# Altium schematic sheet [02] - CPU - IO.SchDoc: Project
size A4; Organization: Tor Brodtkorb; Address1: Frode Rinnans veg 193; Address2: 7050 Trondheim; DocumentNumber: 6598; Revision: 1.0; SheetNumber: 1; SheetTotal: 1
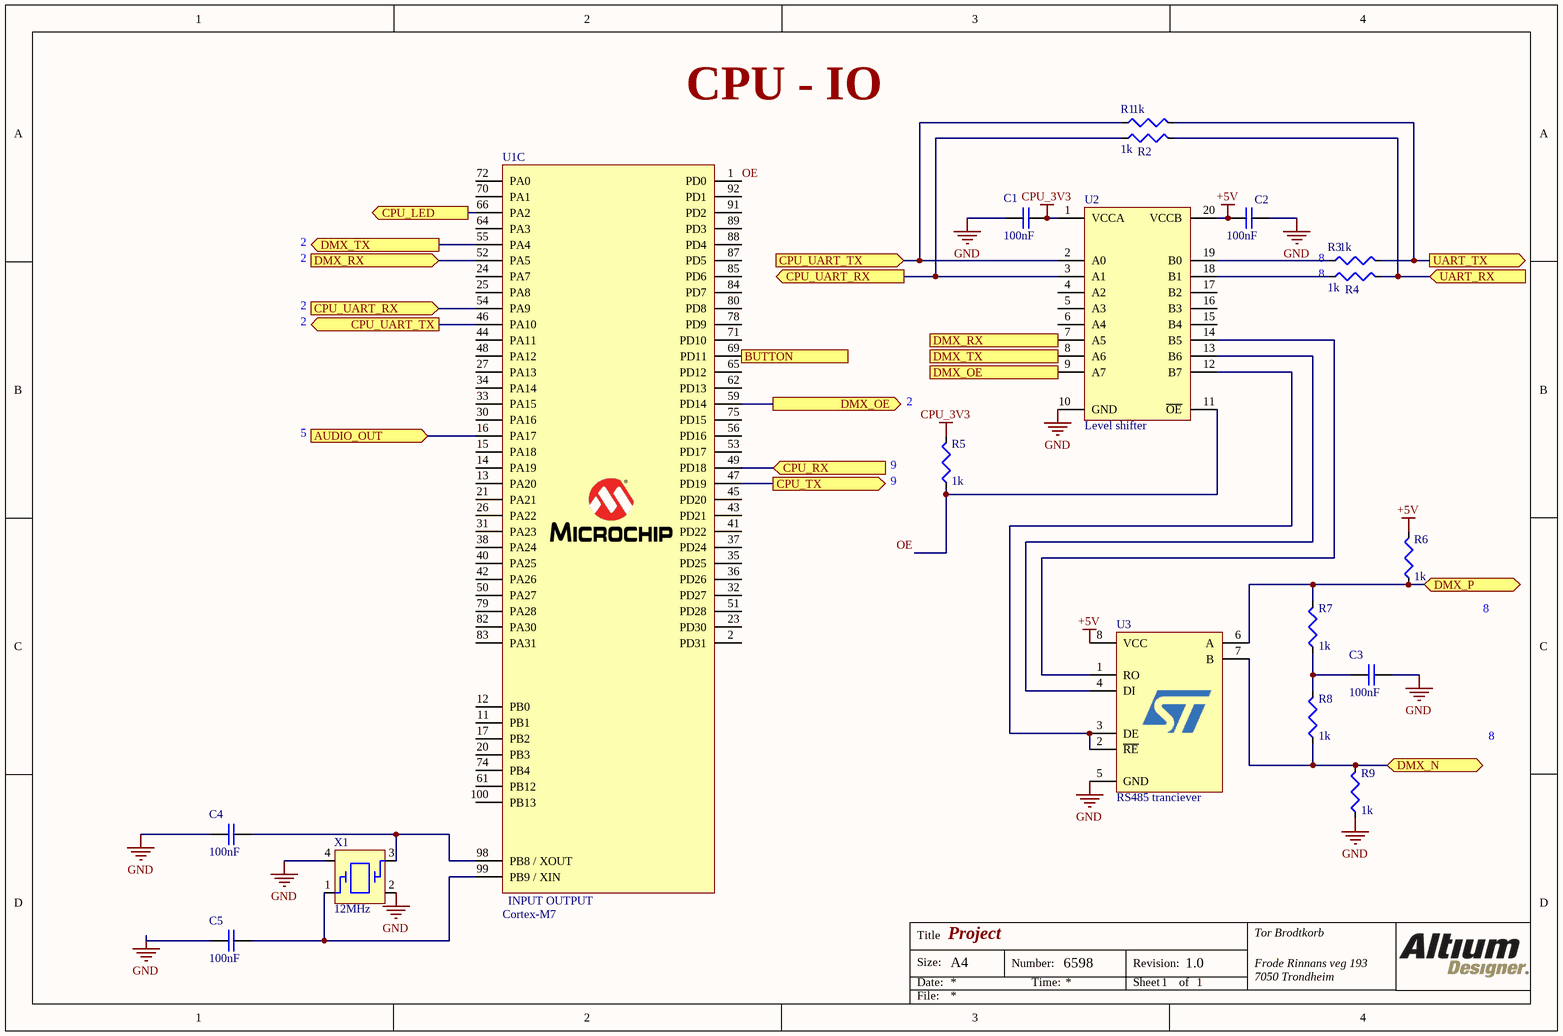
[diagram p0: [02] - CPU - IO.SchDoc]

## Parts
C1  value 100nF  [C0603]  (hidden comment: 02016D104KAT2A)
C2  value 100nF  [C0603]  (hidden comment: 02016D104KAT2A)
C3  value 100nF  [C0603]  (hidden comment: 02016D104KAT2A)
C4  value 100nF  [C0603]  (hidden comment: 02016D104KAT2A)
C5  value 100nF  [C0603]  (hidden comment: 02016D104KAT2A)
R1  value 1k  [R0603]  (hidden comment: CPF-A-0603B100KE1)
R2  value 1k  [R0603]  (hidden comment: CPF-A-0603B100KE1)
R3  value 1k  [R0603]  (hidden comment: CPF-A-0603B100KE1)
R4  value 1k  [R0603]  (hidden comment: CPF-A-0603B100KE1)
R5  value 1k  [R0603]  (hidden comment: CPF-A-0603B100KE1)
R6  value 1k  [R0603]  (hidden comment: CPF-A-0603B100KE1)
R7  value 1k  [R0603]  (hidden comment: CPF-A-0603B100KE1)
R8  value 1k  [R0603]  (hidden comment: CPF-A-0603B100KE1)
R9  value 1k  [R0603]  (hidden comment: CPF-A-0603B100KE1)
U1  Cortex-M7  [ATSAMS70N19A-AN]  (part C of 3)
U2  Level shifter  [FXMA108BQX]
U3  RS485 tranciever  [ST485CDR]
X1  12MHz  [MCSJK-7U-12.00-12-30-80-B-30]

## Ports
AUDIO_OUT (in), BUTTON (in), CPU_LED (out), CPU_RX (in), CPU_TX (out), CPU_UART_RX (in), CPU_UART_RX (out), CPU_UART_TX (in), CPU_UART_TX (out), DMX_N (bidir), DMX_OE (in), DMX_OE (out), DMX_P (bidir), DMX_RX (in), DMX_RX (out), DMX_TX (in), DMX_TX (out), UART_RX (in), UART_TX (out)

## Nets
+5V: C2.2 R6.2 U2.20(VCCB) U3.8(VCC)
CPU_3V3: C1.2 R5.2 U2.1(VCCA)
GND: C1.1 C2.1 C3.1 C4.1 C5.1 R9.1 U2.10(GND) U3.5(GND) X1.2 X1.4
AUDIO_OUT: U1.16(PA17) ; port AUDIO_OUT
BUTTON: U1.69(PD11) ; port BUTTON
CPU_LED: U1.66(PA2) ; port CPU_LED
CPU_RX: U1.49(PD18) ; port CPU_RX
CPU_TX: U1.47(PD19) ; port CPU_TX
CPU_UART_RX: R2.1 U1.54(PA9) U2.3(A1) ; port CPU_UART_RX
CPU_UART_TX: R1.1 U1.46(PA10) U2.2(A0) ; port CPU_UART_TX
DMX_N: R8.1 R9.2 U3.7(B) ; port DMX_N
DMX_OE: U1.59(PD14) U2.9(A7) ; port DMX_OE
DMX_P: R6.1 R7.2 U3.6(A) ; port DMX_P
DMX_RX: U1.52(PA5) U2.7(A5) ; port DMX_RX
DMX_TX: U1.55(PA4) U2.8(A6) ; port DMX_TX
OE: R5.1 U1.1(PD0) U2.11(~{OE})
UART_RX: R2.2 R4.2 ; port UART_RX
UART_TX: R1.2 R3.2 ; port UART_TX
NetC3_2: C3.2 R7.1 R8.2
NetC4_2: C4.2 U1.98(PB8_/_XOUT) X1.3
NetC5_2: C5.2 U1.99(PB9_/_XIN) X1.1
NetR3_1: R3.1 U2.19(B0)
NetR4_1: R4.1 U2.18(B1)
NetU2_12: U2.12(B7) U3.2(~{RE}) U3.3(DE)
NetU2_13: U2.13(B6) U3.4(DI)
NetU2_14: U2.14(B5) U3.1(RO)

Not connected (* = marked no-connect by the designer): U1 2(PD31) 11(PB1) 12(PB0) 13(PA20) 14(PA19) 15(PA18) 17(PB2) 20(PB3) 21(PA21) 23(PD30) 24(PA7) 25(PA8) 26(PA22) 27(PA13) 30(PA16) 31(PA23) 32(PD27) 33(PA15) 34(PA14) 35(PD25) 36(PD26) 37(PD24) 38(PA24) 40(PA25) 41(PD22) 42(PA26) 43(PD21) 44(PA11) 45(PD20) 48(PA12) 50(PA27) 51(PD28) 53(PD17) 56(PD16) 61(PB12) 62(PD13) 64(PA3) 65(PD12) 70(PA1) 71(PD10) 72(PA0) 74(PB4) 75(PD15) 78(PD9) 79(PA28) 80(PD8) 82(PA30) 83(PA31) 84(PD7) 85(PD6) 87(PD5) 88(PD4) 89(PD3) 91(PD2) 92(PD1) 100(PB13); U2 4(A2) 5(A3) 6(A4) 15(B4) 16(B3) 17(B2)

## Notes on the sheet
- CPU - IO
- 2
- (near R3) 8
- 8
- 5
- (near R5) 2
- (near R5) 9
- Title
- Size:
- Date:
- A4
- Number:
- Time:
- Revision:
- Sheet
- of
- File:
- (in symbol ATSAMS70N19A-AN, part C) INPUT OUTPUT

## Library data of the parts
C1-C5 = 02016D104KAT2A: C0603
R1-R9 = CPF-A-0603B100KE1: R0603
U1 = ATSAMS70N19A-AN: ATSAMS70N19
U2 = FXMA108BQX: 8-bit bidirectional level shifter
U3 = ST485CDR
X1 = MCSJK-7U-12.00-12-30-80-B-30: Crystal 12MHz 3.2mm x 2.5mm